# EAGLE design LB_BIT_o7_IRLED-v03(1_1) (EAGLE 6.6.0)
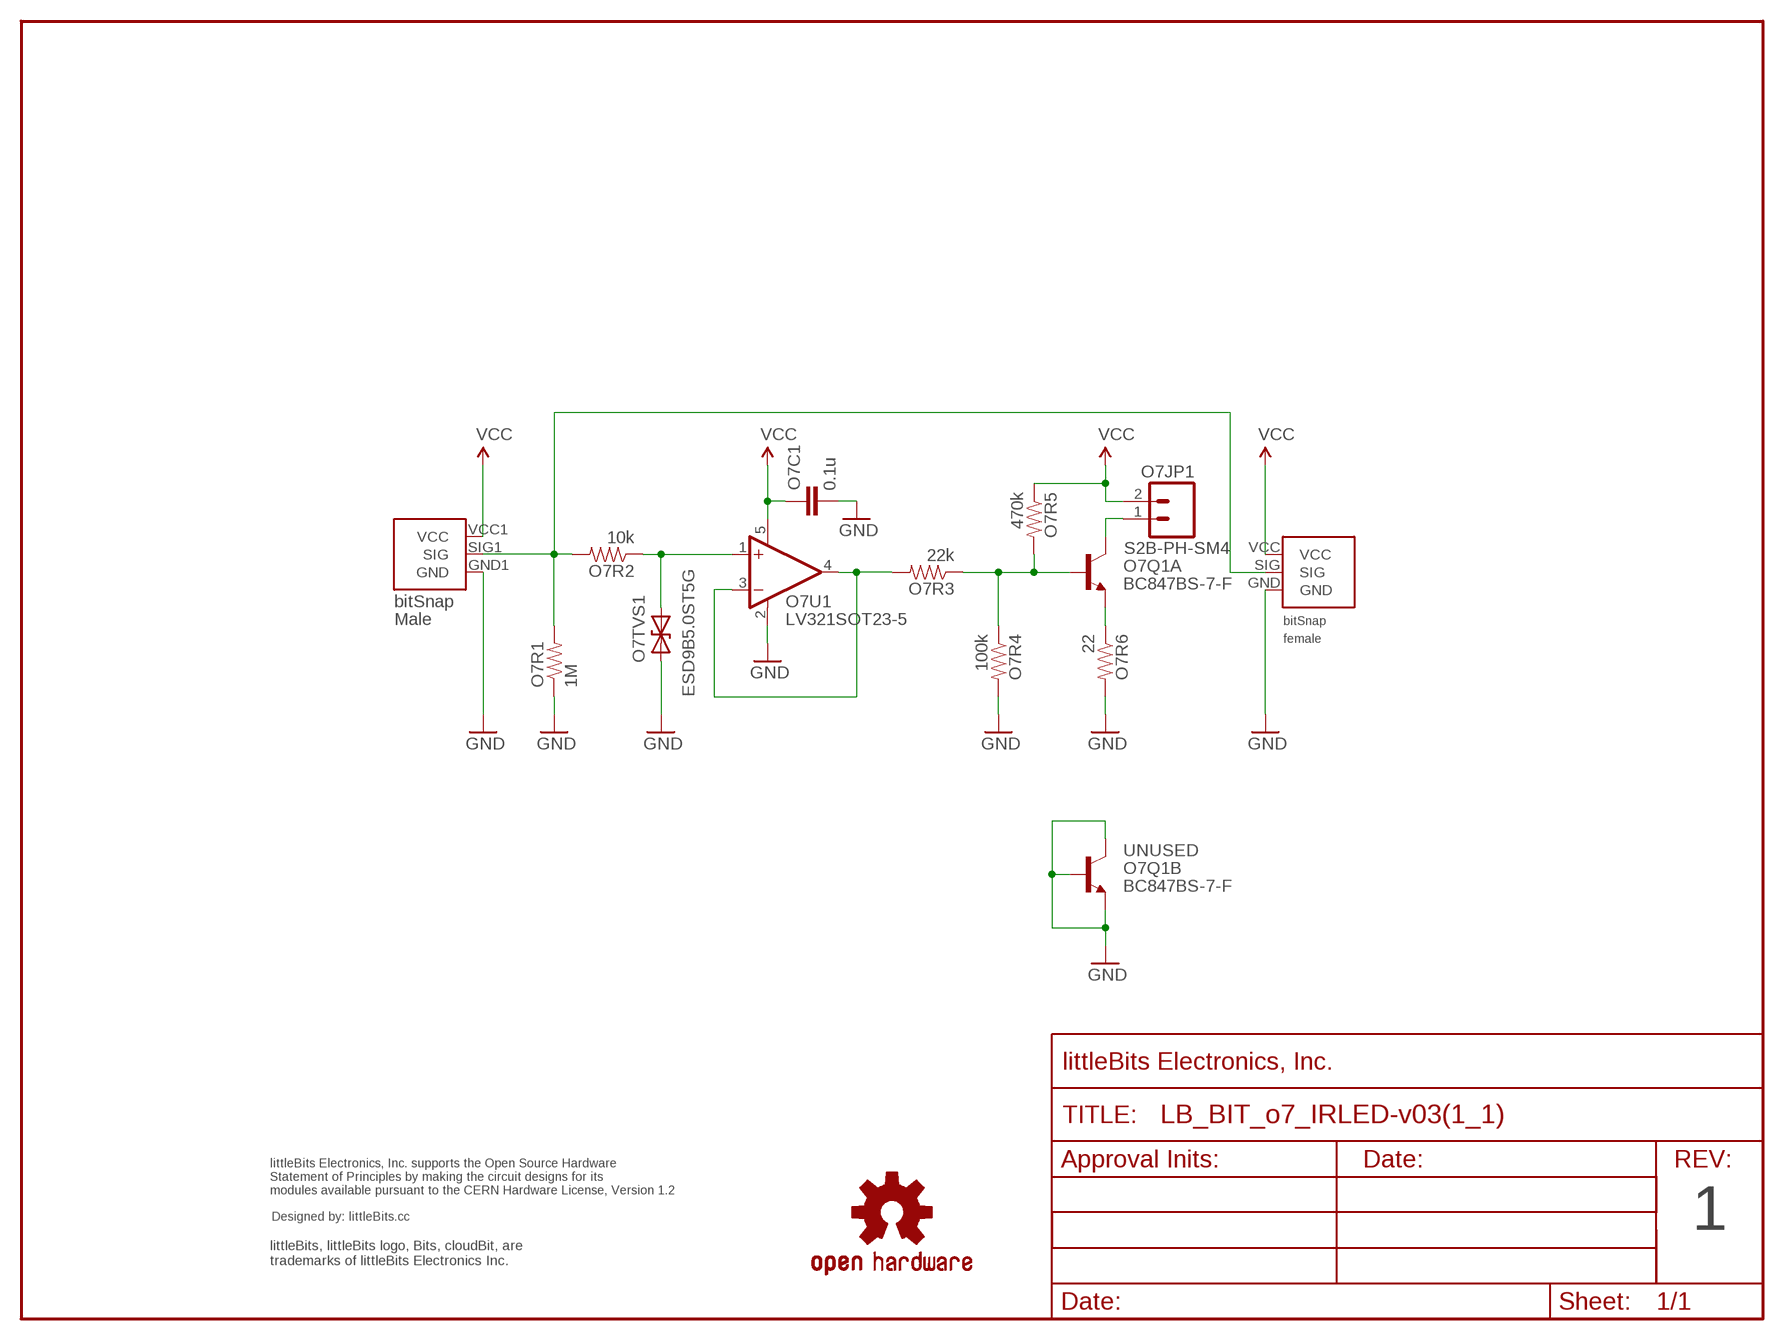
[diagram p0: schematic, sheet 1]

## Parts
O7BSF1  BITSNAP_V03_FEMALE  [BITSNAP_V03_FEMALE]
O7BSM1  BITSNAP_V03_MALE  [BITSNAP_V03_MALE]
O7C1  0.1u  CAPCAP-0603  [CAP-0603]
O7JP1  S2B-PH-SM4  M02-JST-2MM-SMT  [S2B-PH]
O7Q1  BC847BS-7-F  TRANS-BJT_NPN-DUAL-BC847BS  [SOT-363_PHILLIPS]
O7R1  1M  RESISTOR0603  [RES-0603]
O7R2  10k  RESISTOR0603  [RES-0603]
O7R3  22k  RESISTOR0603  [RES-0603]
O7R4  100k  RESISTOR0603  [RES-0603]
O7R5  470k  RESISTOR0603  [RES-0603]
O7R6  22  RESISTOR0603  [RES-0603]
O7TVS1  ESD9B5.0ST5G  DIODE-TVSSOD-923  [SOD-923]
O7U1  LV321SOT23-5  [SOT23-5]
U$5  FRAME-LETTER-OHWOHW  [FABDWG01-OHW]
U$8  OSHWCREDIT  [OSHWCREDIT]
U$14  OSHW-LOGOL  [OSHW-LOGO-L]

## Nets
GND: O7BSF1.GND O7BSM1.GND1(GND) O7C1.2 O7Q1.3(B:C) O7Q1.4(B:E) O7Q1.5(B:B) O7R1.1 O7R4.2 O7R6.2 O7TVS1.1(A) O7U1.2(V-)
N$1: O7JP1.1 O7Q1.6(A:C)
N$2: O7Q1.1(A:E) O7R6.1
N$3: O7Q1.2(A:B) O7R3.1 O7R4.1 O7R5.2
N$4: O7R2.1 O7TVS1.2(C) O7U1.1(+IN)
N$6: O7BSF1.SIG O7BSM1.SIG1(SIG) O7R1.2 O7R2.2
N$8: O7R3.2 O7U1.3(-IN) O7U1.4(OUT)
VCC: O7BSF1.VCC O7BSM1.VCC1(VCC) O7C1.1 O7JP1.2 O7R5.1 O7U1.5(V+)

## Notes on the sheet
- UNUSED
- 1

## Library data of the parts
O7BSF1 = bitSnap:BITSNAP_V03_FEMALE
O7BSM1 = bitSnap:BITSNAP_V03_MALE
O7C1 = LITTLEBITS:CAP
O7JP1 = SparkFun:M02: Header 2 Standard 2-pin 0.1" header. Use with straight break away headers (SKU : PRT-00116), right angle break away headers (PRT-00553), swiss pins (PRT-00743), machine pins (PRT-00117), and female headers (PRT-00115). Molex polarized connector foot print use with SKU : PRT-08233 with associated crimp pins and housings.
O7Q1 = LITTLEBITS:TRANS-BJT_NPN-DUAL
O7R1-O7R6 = LITTLEBITS:RESISTOR
O7TVS1 = LITTLEBITS:DIODE-TVS: Bidirectional Transient Voltage Suppression Diode: Device conducts in avalanche mode after reaching a part dependent voltage threshold. Used for limiting voltage spikes on ESD sensitive inputs and outputs.; IEC_ESD_PROT0: +/-18kV; LB_PN: ?; MPN: ESD9B5.0ST5G; V_CLAMP: ?; V_OPERATION: 5V
O7U1 = LITTLEBITS:LV321
U$5 = LITTLEBITS:FRAME-LETTER-OHW
U$8 = LITTLEBITS:OSHWCREDIT
U$14 = LITTLEBITS:OSHW-LOGO: Open Source Hardware Logo This logo indicates the piece of hardware it is found on incorporates a OSHW license and/or adheres to the definition of open source hardware found here: http://freedomdefined.org/OSHW

## Board
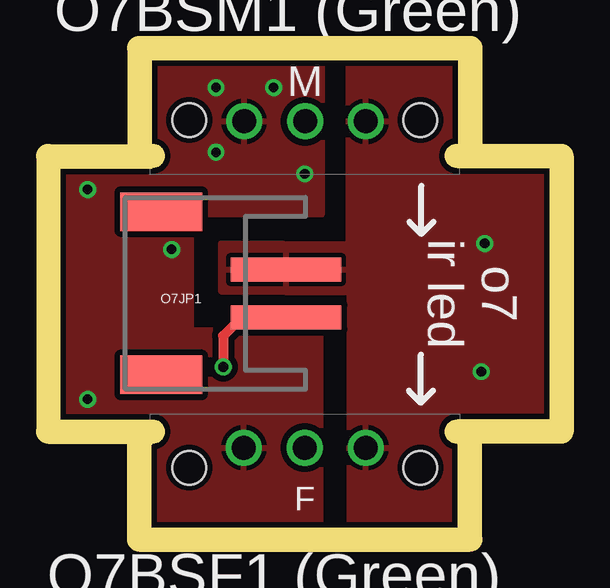
[diagram p1: board, top side]
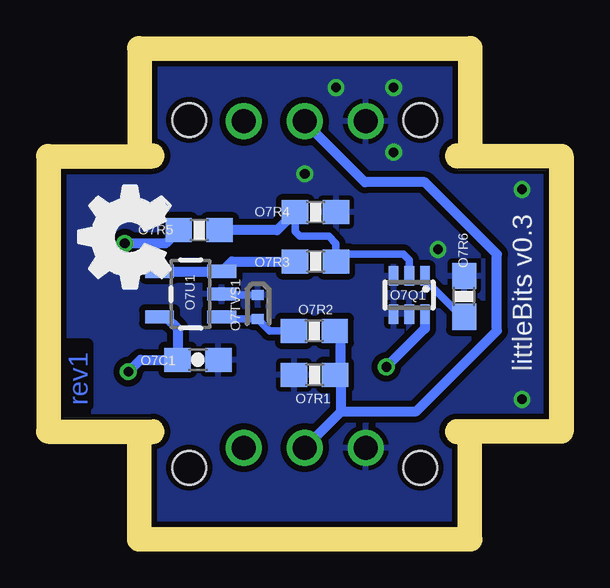
[diagram p2: board, bottom side, seen from below]

Size 20.4 x 19.5 mm. Coordinates in mm from the lower left corner, seen from the top.
Outline: 0,4.5 0,15
Outline: 20.4,15 20.4,4.5
Copper layers (1*16): Top 0.035mm / dielectric 1.5mm / Bottom 0.035mm
Design rules "littleBitsDRC": minimum track width 0.2mm, minimum drill 0.4mm, track to track 0.2mm, track to pad 0.2mm, pad to pad 0.2mm, via to via 0.2mm, smd to smd 0mil, copper to edge 0.2mm, drill to drill 0.2mm, minimum pad ring 0.2mm, minimum via ring 0.15mm, stop-mask expansion 0.1mm, vias tented up to drill 0mil, thermal gap 0.2mm
Milling: 2 lines

### Footprints (pad centres in the part's own frame; a part is rotated, then mirrored left to right if it is on the bottom)
BITSNAP_V03_FEMALE = drill 1: GND 3.91,3.33; SIG 6.45,3.33; VCC 8.99,3.33 | hole 1.4: 1.63,2.5; 11.27,2.5
BITSNAP_V03_MALE = drill 1: GND1 8.98,2.56; SIG1 6.44,2.56; VCC1 3.9,2.56 | hole 1.4: 11.27,2.5; 1.63,2.5
CAP-0603 = smd 1.1 x 1: 1 -0.85,0; 2 0.85,0
S2B-PH = smd 1 x 4.6: 1 -1,-3.7; 2 1,-3.7 | smd 1.6 x 3.4: NC1 -3.4,1.5; NC2 3.4,1.5
SOT-363_PHILLIPS = smd 0.4 x 0.8: 1 -0.65,-0.8; 2 0,-0.8; 3 0.65,-0.8; 4 0.65,0.8; 5 0,0.8; 6 -0.65,0.8
RES-0603 = smd 1.1 x 1: 1 -0.85,0; 2 0.85,0
SOD-923 = smd 0.4 x 0.5: 1 -0.5,0; 2 0.5,0
SOT23-5 = smd 0.55 x 1.2: 1 -0.95,-1.3; 2 0,-1.3; 3 0.95,-1.3; 4 0.95,1.3; 5 -0.95,1.3

### Placement (x,y rotation side)
DRILEGEND  [DRILEGEND]  -10.67,-18.47 0 top  (outside the outline)
O7BSF1  3.75,0 0 top
O7BSM1  16.65,19.5 180 top
O7C1  14.65,7 0 bottom
O7JP1  5.72,9.77 90 top
O7Q1  5.85,9.7 180 bottom
O7R1  9.79,6.36 0 bottom
O7R2  9.8,8.2 0 bottom
O7R3  9.75,11.1 180 bottom
O7R4  9.75,13.15 0 bottom
O7R5  14.6,12.4 0 bottom
O7R6  3.56,9.64 90 bottom
O7TVS1  12.15,9.2 270 bottom
O7U1  14.96,9.74 90 bottom
U$5  0,0 0 top
U$7  [OSHW_FILLX150_NOTEXT]  15.81,9.16 0 top
U$8  -93.55,-63.5 0 top  (outside the outline)
U$14  -32.49,-68.63 0 top  (outside the outline)

### Tracks (layer width: path | path; a pad name or v marks a point on that pad's centre or on a via)
GND  (via drill 0.41)
  Bottom 0.305: O7TVS1.1 13.62,9.7 O7U1.2
  other vias: 1.15,14.1 1.15,5.35 6.5,15.65 6.5,18.35 8.9,18.35 10.2,14.75 4.65,11.6
  pour Top (isolate 0.254): 0.17,19.33 10.9,19.33 10.9,13.05 5.45,13.05 5.45,8.25 10.85,8.25 10.85,0.17 0.17,0.22
  pour Bottom (isolate 0.254): 0.17,19.33 20.2,19.33 20.2,0.17 0.17,0.22
N$1  (via drill 0.41)
  Top 0.406: O7JP1.1 7.57,8.77 6.8,8 v6.8,6.7
  Bottom 0.406: O7Q1.6 5.2,8.3 v6.8,6.7
N$2
  Bottom 0.305: O7R6.1 3.64,8.79 5.2,10.35 O7Q1.1
N$3
  Bottom 0.305: O7Q1.2 5.85,11.15 6.1,11.4 8.6,11.4 O7R3.1 8.9,11.85 9.2,12.15 10.4,12.15 10.6,12.35 O7R4.1
  Bottom 0.406: O7R4.1 11.35,12.4 O7R5.2
N$4
  Bottom 0.305: O7U1.1 13.57,8.7 O7TVS1.2 11.65,8.2 O7R2.1
N$6
  Bottom 0.406: 8.68,4.85 5.55,4.85 2.2,8.2 2.2,11.4 5.2,14.4 7.7,14.4 10.21,16.91 O7BSM1.SIG1 | 8.68,4.85 O7BSF1.SIG | 8.68,4.85 8.68,6.2 O7R1.2 8.7,6.6 8.7,7.95 O7R2.2
N$8
  Bottom 0.406: O7U1.4 O7U1.3 13.24,11.1 O7R3.2
VCC  (via drill 0.41)
  Bottom 0.406: v17.55,6.5 17.05,7 O7C1.1 15.5,8.3 15.99,8.79 O7U1.5 | O7R5.1 16,11.85 v17.7,11.85
  pour Top (isolate 0.254): 12,19.4 12,11.8 6.7,11.85 6.7,9.85 12.05,9.8 12.05,0.15 20.25,0.15 20.25,19.4

### Text on the board
Bottom: rev1
tPlace: o7 / ir led
bPlace: littleBits v0.3
tNames: O7BSM1 (Green) | O7BSF1 (Green)
Milling: 1mm DIA. ROUTER PATH
dxf: 1 | IR LED Bit
DrillLegend: LAYER-STACK
DrillLegend_01-16: 01-16
DrillLegend_01-20: 01-20